# Altium schematic sheet PWM_Filter.SchDoc
size A; SheetNumber: 7; SheetTotal: 6
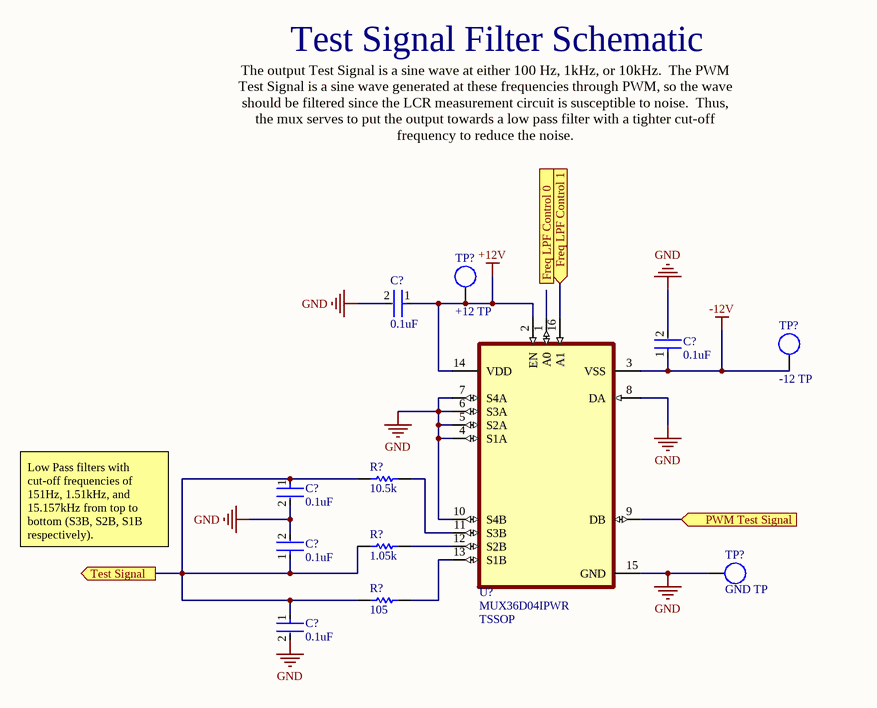
[diagram p0: PWM_Filter.SchDoc]

## Parts
(Parts that share a designator on the sheet are numbered #1, #2 ... from top to bottom, then left to right.)
C?#1  0.1uF  [FP-C0805C-DG-MFG]
C?#2  0.1uF  [FP-C0805C-DG-MFG]
C?#3  0.1uF  [FP-C0805C-DG-MFG]
C?#4  0.1uF  [FP-C0805C-DG-MFG]
C?#5  0.1uF  [FP-C0805C-DG-MFG]
R?#1  10.5k  [RESC2013X50X30LL20T20]
R?#2  1.05k  [RESC2013X50X30LL20T20]
R?#3  105  [RESC2013X50X30LL20T20]
TP?#1  +12 TP  [PCBComponent_1]
TP?#2  -12 TP  [PCBComponent_1]
TP?#3  GND TP  [PCBComponent_1]
U?  MUX36D04IPWR  Package: TSSOP  [SOP65P640X120-16N]

## Ports
Freq LPF Control 0 (in), Freq LPF Control 1 (in), PWM Test Signal (in), Test Signal (out)

## Nets
+12V: C?#1.1 TP?#1.TP U?.2(EN) U?.14(VDD)
-12V: C?#2.1 TP?#2.TP U?.3(VSS)
GND: C?#1.2 C?#2.2 C?#3.2 C?#4.2 C?#5.2 TP?#3.TP U?.4(S1A) U?.5(S2A) U?.6(S3A) U?.7(S4A) U?.8(DA) U?.10(S4B) U?.15(GND)
Freq LPF Control 1: U?.16(A1) ; port Freq LPF Control 1
PWM Test Signal: U?.9(DB) ; port PWM Test Signal
Test Signal: C?#3.1 C?#4.1 C?#5.1 R?#1.2 R?#2.2 R?#3.2 ; port Test Signal
NetR?#1_1: R?#1.1 U?.11(S3B)
NetR?#2_1: R?#2.1 U?.12(S2B)
NetR?#3_1: R?#3.1 U?.13(S1B)

Not connected (* = marked no-connect by the designer): U? 1(A0)

## Notes on the sheet
- Test Signal Filter Schematic
- The output Test Signal is a sine wave at either 100 Hz, 1kHz, or 10kHz.  The PWM Test Signal is a sine wave generated at these frequencies through PWM, so the wave should be filtered since the LCR measurement circuit is susceptible to noise.  Thus, the mux serves to put the output towards a low pass filter with a tighter cut-off frequency to reduce the noise.
- Low Pass filters with cut-off frequencies of 151Hz, 1.51kHz, and 15.157kHz from top to bottom (S3B, S2B, S1B respectively).

## Library data of the parts
C?#1-C?#5 = CMP-2007-03243-2: CAP CER 10UF 10V X5R 0805; Manufacturer Part Number: C0805C106K8PACTU; Manufacturer: Kemet; 3DS Part Number: 220-00001; Tolerance: 10%; Temperature Coefficient: 15%; Material: Ceramic; Device Class L2: Capacitors; Device Class L1: Passive Components; ComponentLink2URL: https://content.kemet.com/datasheets/KEM_C1006_X5R_SMD.pdf; Height: 1.4mm; Lead Free: Yes; Digikey Description: CAP CER 10UF 10V X5R 0805; Octopart: https://octopart.com/c0805c106k8pactu-kemet-98697; Capacitance: 10uF; Value: 10uF; Temperature Range Low: -55°C; Temperature: -55°C to +85°C; Automotive: No; Mouser Description: CAP CER 10UF 10V X5R 0805; Ipc Land Pattern Name: CAPC200125X125; Temperature Range High: +85°C; Voltage: 10V; RoHS: TRUE; Device Class L3: Ceramic Capacitors; ComponentLink2Description: Datasheet; Voltage Rating: 10V; Package: C0805C-DG; Temperature Characteristic: X5R; Category: Cap
R?#1-R?#3 = CMP-2001-04896-1: Manufacturer: Vishay Dale; Part Number: CRCW08050000Z0EA
TP?#1-TP?#3 = Component_1
U? = MUX36D04IPWR: Price: None; Value: *; MP: MUX36D04IPWR; Availability: Unavailable